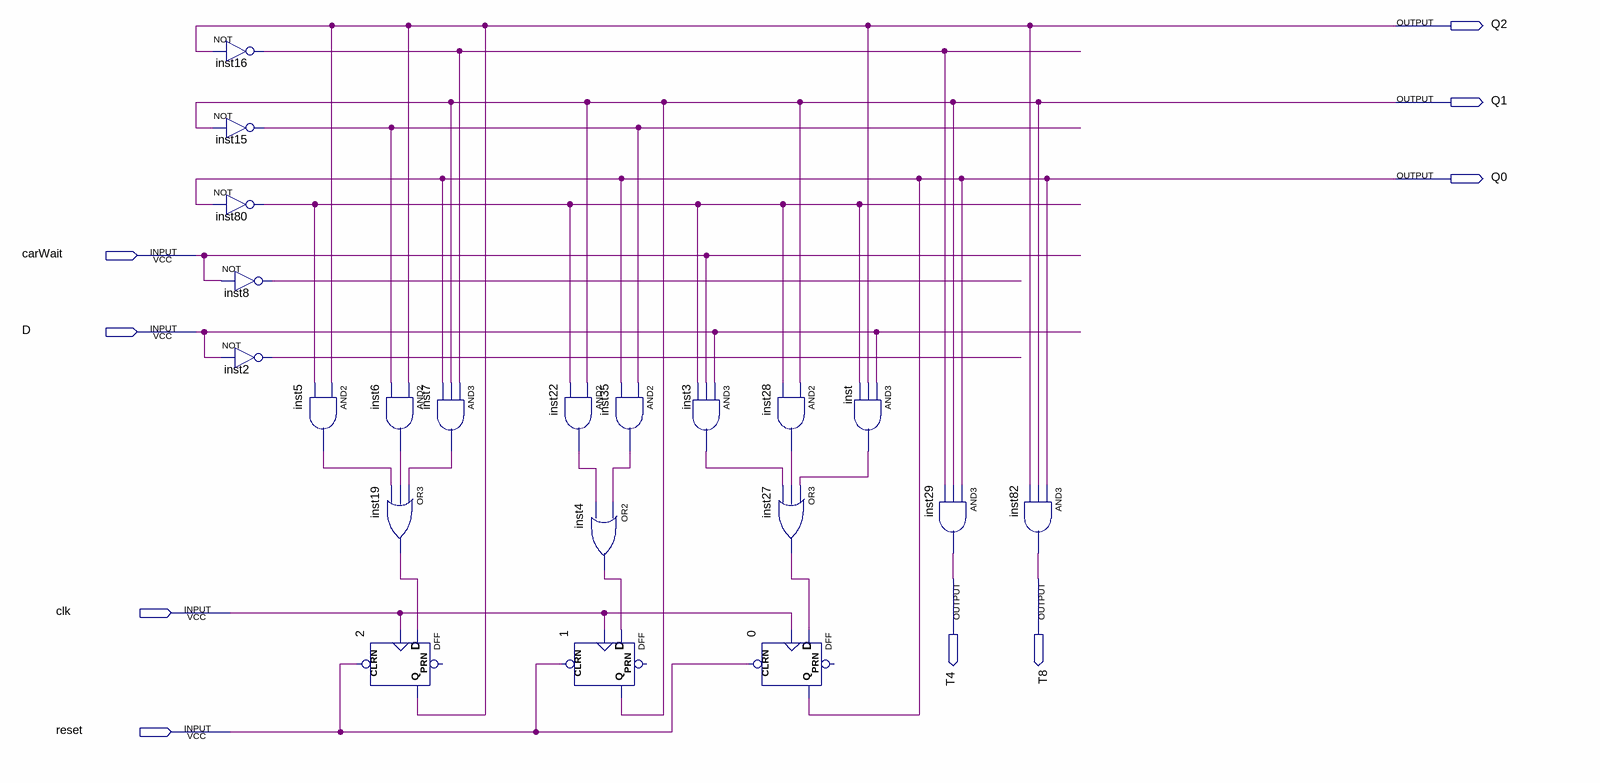
[diagram p0: schematic sheet]
// Quartus schematic TLC.bdf as structural Verilog: 21 symbols, 9 pins
module TLC (
  input  carWait,
  input  D,
  input  clk,
  input  reset,
  output Q2,
  output Q1,
  output Q0,
  output T4,
  output T8
);

  wire inst2_out, inst3_out, inst4_out, inst5_out, inst6_out, inst7_out, inst8_out, inst15_out, inst16_out,
       inst19_out, inst22_out, inst27_out, inst28_out, inst35_out, inst80_out, inst_out;

  not inst16 (inst16_out, Q2);
  not inst15 (inst15_out, Q1);
  not inst80 (inst80_out, Q0);
  not inst8 (inst8_out, carWait);
  not inst2 (inst2_out, D);
  and inst5 (inst5_out, Q2, inst80_out);
  and inst6 (inst6_out, Q2, inst15_out);
  or inst19 (inst19_out, inst7_out, inst6_out, inst5_out);
  DFF u_2 (.CLRN(reset), .CLK(clk), .D(inst19_out), .Q(Q2));  // open: PRN
  and inst7 (inst7_out, inst16_out, Q1, Q0);
  and inst22 (inst22_out, Q1, inst80_out);
  and inst35 (inst35_out, inst15_out, Q0);
  or inst4 (inst4_out, inst35_out, inst22_out);
  DFF u_1 (.CLRN(reset), .CLK(clk), .D(inst4_out), .Q(Q1));  // open: PRN
  and inst3 (inst3_out, D, carWait, inst80_out);
  DFF u_0 (.CLRN(reset), .CLK(clk), .D(inst27_out), .Q(Q0));  // open: PRN
  and inst28 (inst28_out, Q1, inst80_out);
  or inst27 (inst27_out, inst_out, inst28_out, inst3_out);
  and inst (inst_out, D, Q2, inst80_out);
  and inst29 (T4, Q0, Q1, inst16_out);
  and inst82 (T8, Q0, Q1, Q2);
endmodule
